# EAGLE design m1284prog (EAGLE 9.4.2)
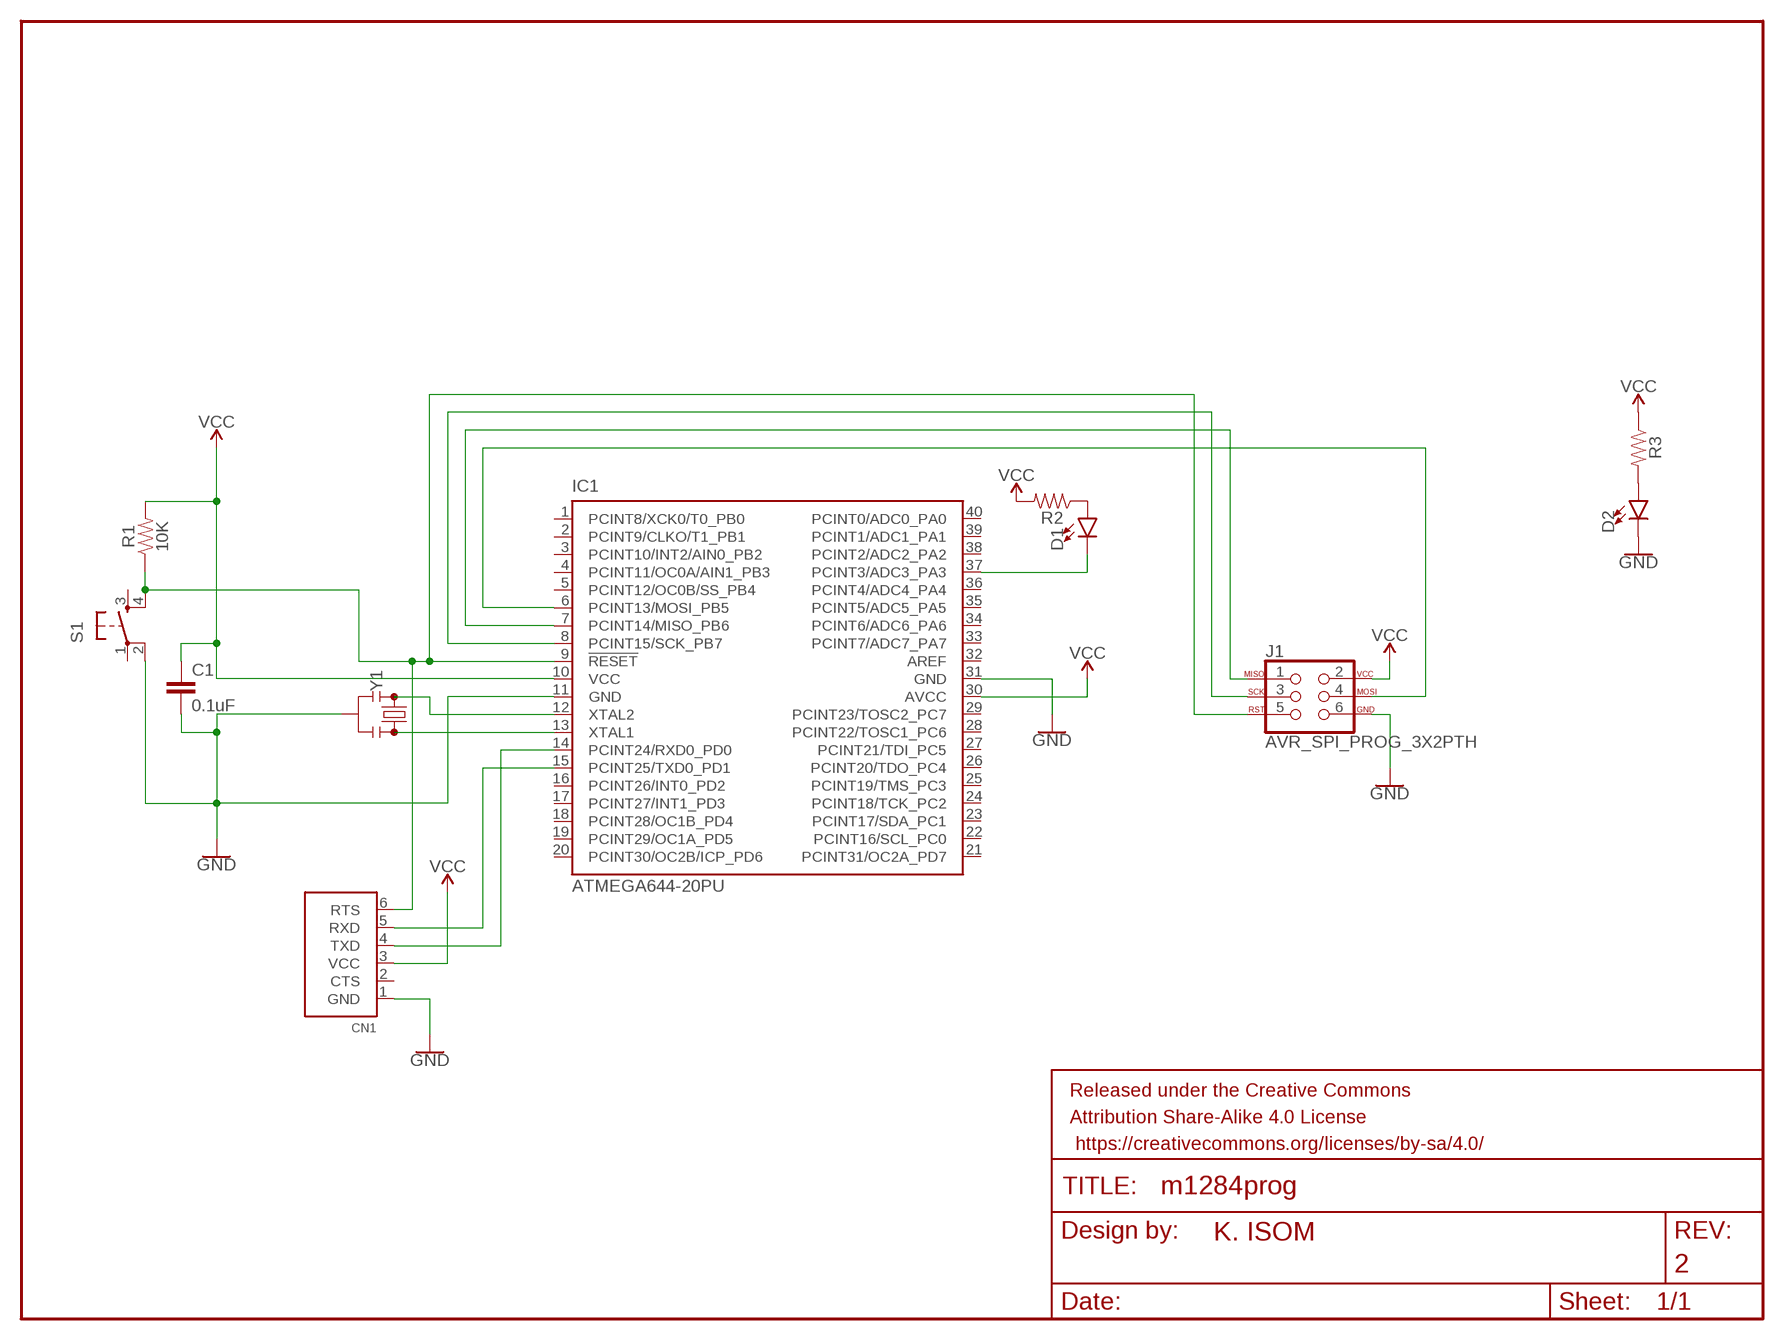
[diagram p0: schematic, sheet 1]

## Parts
C1  0.1uF  C2,5-3  [C2.5-3]
CN1  FTDIUSBCABLE  [1X06_ROUND]
D1  LED3MM  [LED_3MM]
D2  LED3MM  [LED_3MM]
FRAME1  FRAME-LETTER  [CREATIVE_COMMONS]
IC1  ATMEGA644-20PU  [DIL40]
J1  AVR_SPI_PROG_3X2PTH  [2X3]
R1  10K  RESISTORAXIAL-0.3  [AXIAL-0.3]
R2  RESISTORAXIAL-0.3  [AXIAL-0.3]
R3  RESISTORAXIAL-0.3  [AXIAL-0.3]
S1  TAC_SWITCHPTH  [TACTILE-PTH]
Y1  RESONATORPTH-7.6X3.8  [RESONATOR-PTH-7.6X3.8]

## Nets
GND: C1.2 CN1.1(GND) D2.K(C) IC1.11(GND) IC1.31(GND) J1.6 S1.2 Y1.2
N$1: IC1.12(XTAL2) Y1.1
N$2: IC1.13(XTAL1) Y1.3
N$3: IC1.6(PCINT13/MOSI_PB5) J1.4
N$4: CN1.6(RTS) IC1.9(!RESET) J1.5 R1.P$1 S1.4
N$5: IC1.7(PCINT14/MISO_PB6) J1.1
N$6: IC1.8(PCINT15/SCK_PB7) J1.3
N$7: D1.K(C) IC1.37(PCINT3/ADC3_PA3)
N$8: D1.A R2.P$1
N$9: CN1.4(TXD) IC1.14(PCINT24/RXD0_PD0)
N$10: CN1.5(RXD) IC1.15(PCINT25/TXD0_PD1)
N$11: D2.A R3.P$2
VCC: C1.1 CN1.3(VCC) IC1.10(VCC) IC1.30(AVCC) J1.2 R1.P$2 R2.P$2 R3.P$1
Unconnected: CN1.2(CTS) IC1.1(PCINT8/XCK0/T0_PB0) IC1.2(PCINT9/CLKO/T1_PB1) IC1.3(PCINT10/INT2/AIN0_PB2) IC1.4(PCINT11/OC0A/AIN1_PB3) IC1.5(PCINT12/OC0B/SS_PB4) IC1.16(PCINT26/INT0_PD2) IC1.17(PCINT27/INT1_PD3) IC1.18(PCINT28/OC1B_PD4) IC1.19(PCINT29/OC1A_PD5) IC1.20(PCINT30/OC2B/ICP_PD6) IC1.21(PCINT31/OC2A_PD7) IC1.22(PCINT16/SCL_PC0) IC1.23(PCINT17/SDA_PC1) IC1.24(PCINT18/TCK_PC2) IC1.25(PCINT19/TMS_PC3) IC1.26(PCINT20/TDO_PC4) IC1.27(PCINT21/TDI_PC5) IC1.28(PCINT22/TOSC1_PC6) IC1.29(PCINT23/TOSC2_PC7) IC1.32(AREF) IC1.33(PCINT7/ADC7_PA7) IC1.34(PCINT6/ADC6_PA6) IC1.35(PCINT5/ADC5_PA5) IC1.36(PCINT4/ADC4_PA4) IC1.38(PCINT2/ADC2_PA2) IC1.39(PCINT1/ADC1_PA1) IC1.40(PCINT0/ADC0_PA0) S1.1 S1.3

## Library data of the parts
C1 = capacitor-wima:C: CAPACITOR naming: grid - package width
CN1 = microbuilder:FTDIUSBCABLE: FTDI TTL-232R USB Cable Connector for FTDI's USB->RS232 Cable
D1 D2 = SparkFun-LED:LED: LED (Generic) Standard schematic elements and footprints for 5mm, 3mm, 1206, and 0603 sized LEDs. Generic LEDs with no color specified.; PROD_ID: DIO-08794
FRAME1 = SparkFun-Aesthetics:FRAME-LETTER: Schematic Frame - Letter Standard 8.5x11 US Letter frame; DESIGNER: K. ISOM; REV: 2
IC1 = atmel:ATMEGA644-*PU: 8-bit Microcontroller with 64K Bytes In-System Programmable Flash Auto generated by make-symbol-device-package-bsdl.ulp Rev. 34 Source: http://www.atmel.com/dyn/resources/prod_documents/doc2593.pdf; MPN: ATMEGA644-20PU; OC_FARNELL: 1288340; OC_NEWARK: 23M5060
J1 = SparkFun-Connectors:AVR_SPI_PROG_3X2: AVR ISP 6 Pin This is the reduced ISP connector for AVR programming. Common on Arduino. This footprint will take up less PCB space and can be used with a 10-pin to 6-pin adapter such as SKU: BOB-08508 **Special note about "TEST_POINT" package. The stop mask is on the top side, so if you want your programming test points to be on the bottom of your board, make sure to place this package on the bottom side of the board. This also ensure that the orientation to program from the bottom side will be correct. SparkFun Products: SparkFun ISP Pogo Adapter <https://www.sparkfun.com/products/11591> - NS Tiny AVR Programmer <https://www.sparkfun.com/products/11801> -PTH
R1-R3 = SparkFun-Resistors:RESISTOR: Generic Resistor Package
S1 = SparkFun-Retired:TAC_SWITCH: Momentary Switch Button commonly used for reset or general input. Spark Fun Electronics SKU : COM-00097 SMT- SWCH-08247
Y1 = SparkFun-Clocks:RESONATOR: Resonators (Generic) Ceramic resonators are clock-generating components, often used to control timing in microcontrollers. They usually have 3 pins: two pins for oscillation, and one pin for ground. Compared to crystals, resonators have worse tolerance, but are usually much cheaper. Plus, they have built-in load capacitors! These devices are used on boards like the Arduino Pro 8MHz <https://www.sparkfun.com/products/11114> and Arduino Pro 16MHz <https://www.sparkfun.com/products/11113>.

## Board
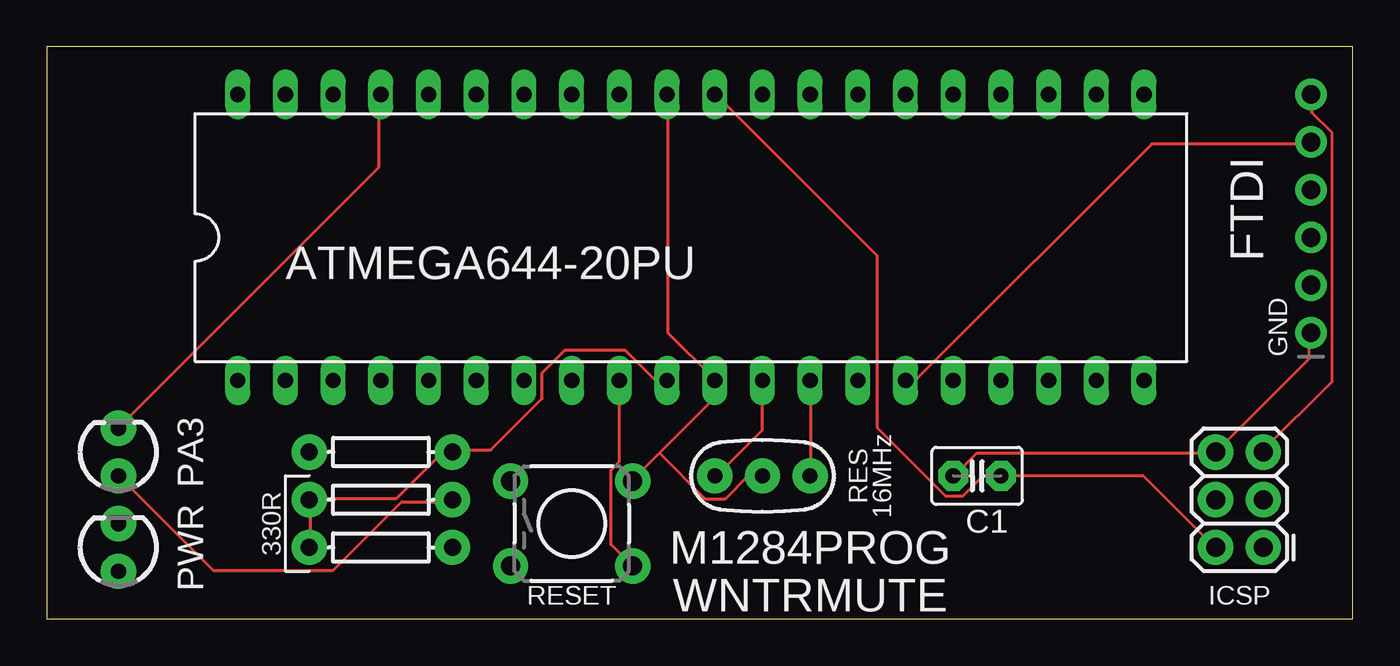
[diagram p1: board, top side]
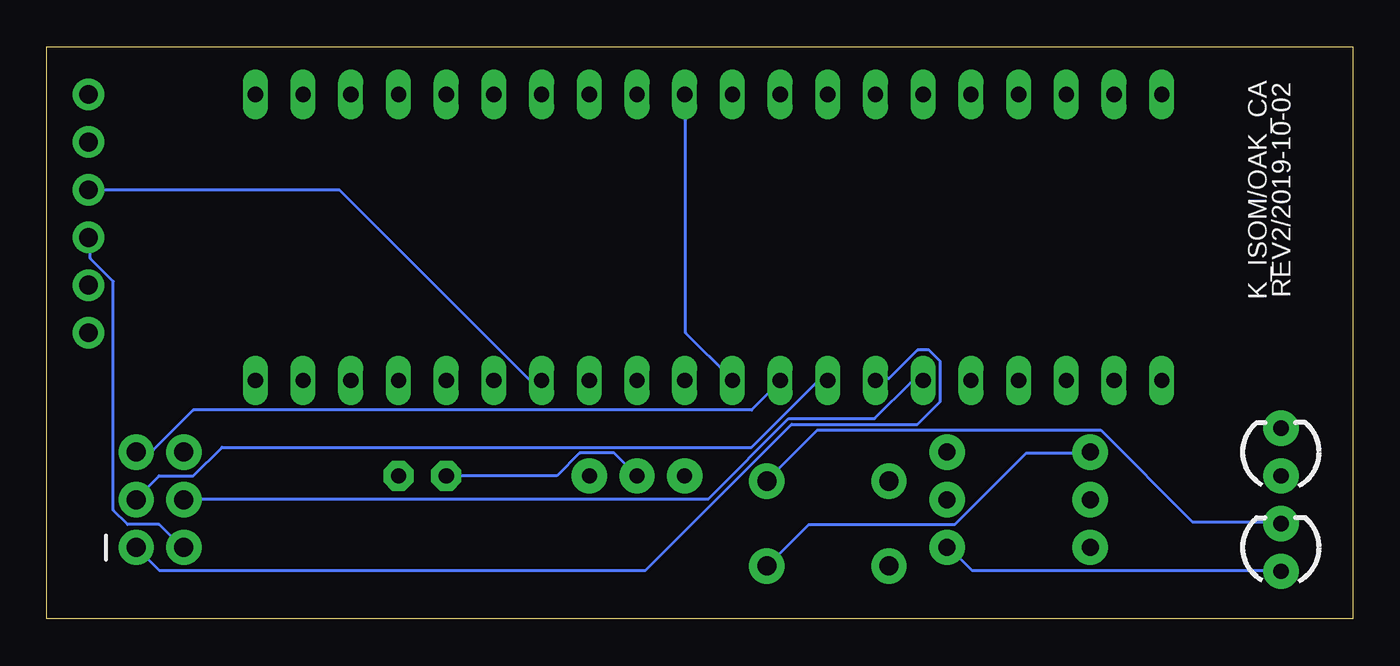
[diagram p2: board, bottom side, seen from below]

Size 69.52 x 30.47 mm. Coordinates in mm from the lower left corner, seen from the top.
Outline: 0,0 69.52,0 69.52,30.47 0,30.47 0,0
Copper layers (1*16): Top 0.035mm / dielectric 1.5mm / Bottom 0.035mm
Design rules "default": minimum track width 6mil, minimum drill 0.35mm, track to track 6mil, track to pad 6mil, pad to pad 6mil, via to via 6mil, smd to smd 6mil, copper to edge 40mil, drill to drill 6mil, minimum pad ring 10mil, minimum via ring 8mil, stop-mask expansion 4mil, vias tented up to drill 0mil, thermal gap 10mil

### Footprints (pad centres in the part's own frame; a part is rotated, then mirrored left to right if it is on the bottom)
C2.5-3 = drill 0.813 pad 1.6 octagon: 1 -1.27,0; 2 1.27,0
1X06_ROUND = drill 1 pad 1.676: 1 -6.35,0; 2 -3.81,0; 3 -1.27,0; 4 1.27,0; 5 3.81,0; 6 6.35,0
LED_3MM = drill 0.813 pad 1.88: A -1.27,0; K 1.27,0
DIL40 = drill 0.813 long: 1 -24.13,-7.62; 2 -21.59,-7.62; 3 -19.05,-7.62; 4 -16.51,-7.62; 5 -13.97,-7.62; 6 -11.43,-7.62; 7 -8.89,-7.62; 8 -6.35,-7.62; 9 -3.81,-7.62; 10 -1.27,-7.62; 11 1.27,-7.62; 12 3.81,-7.62; 13 6.35,-7.62; 14 8.89,-7.62; 15 11.43,-7.62; 16 13.97,-7.62; 17 16.51,-7.62; 18 19.05,-7.62; 19 21.59,-7.62; 20 24.13,-7.62; 21 24.13,7.62; 22 21.59,7.62; 23 19.05,7.62; 24 16.51,7.62; 25 13.97,7.62; 26 11.43,7.62; 27 8.89,7.62; 28 6.35,7.62; 29 3.81,7.62; 30 1.27,7.62; 31 -1.27,7.62; 32 -3.81,7.62; 33 -6.35,7.62; 34 -8.89,7.62; 35 -11.43,7.62; 36 -13.97,7.62; 37 -16.51,7.62; 38 -19.05,7.62; 39 -21.59,7.62; 40 -24.13,7.62
2X3 = drill 1.016 pad 1.88: 1 0,0; 2 0,2.54; 3 2.54,0; 4 2.54,2.54; 5 5.08,0; 6 5.08,2.54
AXIAL-0.3 = drill 0.9 pad 1.88: P$1 -3.81,0; P$2 3.81,0
TACTILE-PTH = drill 1.016 pad 1.88: 1 -3.251,2.261; 2 3.251,2.261; 3 -3.251,-2.261; 4 3.251,-2.261
RESONATOR-PTH-7.6X3.8 = drill 0.8 pad 1.88: 1 -2.54,0; 2 0,0; 3 2.54,0

### Placement (x,y rotation side)
C1  49.53,7.62 180 top
CN1  67.31,21.59 90 top
D1  3.81,8.89 90 top
D2  3.81,3.81 90 top
FRAME1  21.59,-8.89 0 top  (outside the outline)
IC1  34.29,20.32 0 top
J1  64.77,3.81 90 top
R1  17.78,8.89 0 top
R2  17.78,6.35 180 top
R3  17.78,3.81 0 top
S1  27.94,5.08 0 top
Y1  38.1,7.62 0 top

### Tracks (layer width: path | path; a pad name or v marks a point on that pad's centre or on a via)
GND
  Top 0.152: CN1.1 67.21,15.24 67.21,13.87 J1.6 62.18,8.84 49.53,8.84 48.31,7.62 C1.2 | 32.61,8.84 31.24,7.47 S1.2 | 32.61,8.84 35.51,11.73 35.51,12.65 IC1.11 35.51,12.8 33.07,15.24 33.07,27.89 IC1.31 | Y1.2 37.34,7.62 36.12,6.4 35.05,6.4 32.61,8.84
  Bottom 0.152: C1.2 42.37,7.62 41.15,8.84 39.32,8.84 Y1.2 | D2.K 3.81,5.18 8.53,5.18 13.41,10.06 28.5,10.06 31.09,7.47 S1.2
N$1
  Top 0.152: IC1.12 38.1,10.06 35.66,7.62 Y1.1
N$2
  Top 0.152: IC1.13 40.69,12.65 40.69,7.62 Y1.3
N$3
  Bottom 0.152: IC1.6 22.86,12.65 23.47,12.65 25.45,10.67 30.02,10.67 34.29,6.4 62.18,6.4 J1.4
N$4
  Top 0.152: CN1.6 67.36,27.89 67.36,26.98 68.43,25.91 68.43,12.65 64.77,8.99 J1.5 | IC1.9 30.48,8.38 30.02,7.92 30.02,3.96 31.09,2.9 S1.4
  Bottom 0.152: R1.P$1 14.02,8.84 17.37,8.84 21.18,5.03 28.96,5.03 31.09,2.9 S1.4 | J1.5 64.77,8.99 63.86,8.99 61.72,11.12 32,11.12 30.48,12.65 IC1.9
N$5
  Bottom 0.152: J1.1 63.55,2.59 37.64,2.59 29.87,10.36 23.16,10.36 21.95,11.58 21.95,13.72 22.55,14.33 23.16,14.33 24.69,12.8 25.3,12.8 IC1.7
N$6
  Bottom 0.152: IC1.8 28.04,12.65 28.5,12.65 32,9.14 60.2,9.14 61.72,7.62 63.55,7.62 64.77,6.4 J1.3
N$7
  Top 0.152: IC1.37 17.68,27.89 17.68,24.08 3.81,10.21 D1.K
N$8
  Top 0.152: D1.A 8.84,2.59 15.24,2.59 18.9,6.25 21.49,6.25 R2.P$1
N$9
  Bottom 0.152: CN1.4 53.95,22.86 43.89,12.8 43.28,12.8 IC1.14
N$10
  Top 0.152: IC1.15 45.72,12.8 46.33,12.8 58.83,25.3 67.21,25.3 CN1.5
N$11
  Bottom 0.152: D2.A 3.81,2.59 20.27,2.59 21.49,3.81 R3.P$2
VCC
  Top 0.152: J1.2 62.18,3.81 58.37,7.62 C1.1 49.84,7.62 48.77,6.55 47.85,6.55 44.2,10.21 44.2,19.36 35.66,27.89 IC1.30 | R3.P$1 14.02,3.81 14.02,6.25 R2.P$2 14.02,6.4 18.59,6.4 21.03,8.84 21.49,8.84 R1.P$2 21.64,8.99 23.62,8.99 26.36,11.73 26.36,13.11 27.58,14.33 30.79,14.33 32.31,12.8 32.92,12.8 IC1.10
  Bottom 0.152: CN1.3 67.21,20.27 67.21,19.2 65.99,17.98 65.99,5.79 65.23,5.03 63.55,5.03 62.33,3.81 J1.2 | IC1.30 35.51,27.89 35.51,15.24 33.07,12.8 IC1.10

### Text on the board
tPlace: FTDI | GND | PA3 | RES | 16MHz | 330R | PWR | M1284PROG | RESET | WNTRMUTE | ICSP
bPlace: REV2/2019-10-02 | K_ISOM/OAK_CA